# Altium schematic sheet pca10090_sheet3_nrf52840.SchDoc: nRF52840
size A3; Organization: Nordic Semiconductor; DocumentNumber: 3; SheetNumber: 3; SheetTotal: 8; CompanyName: Nordic Semiconductor; DocumentSize: A3
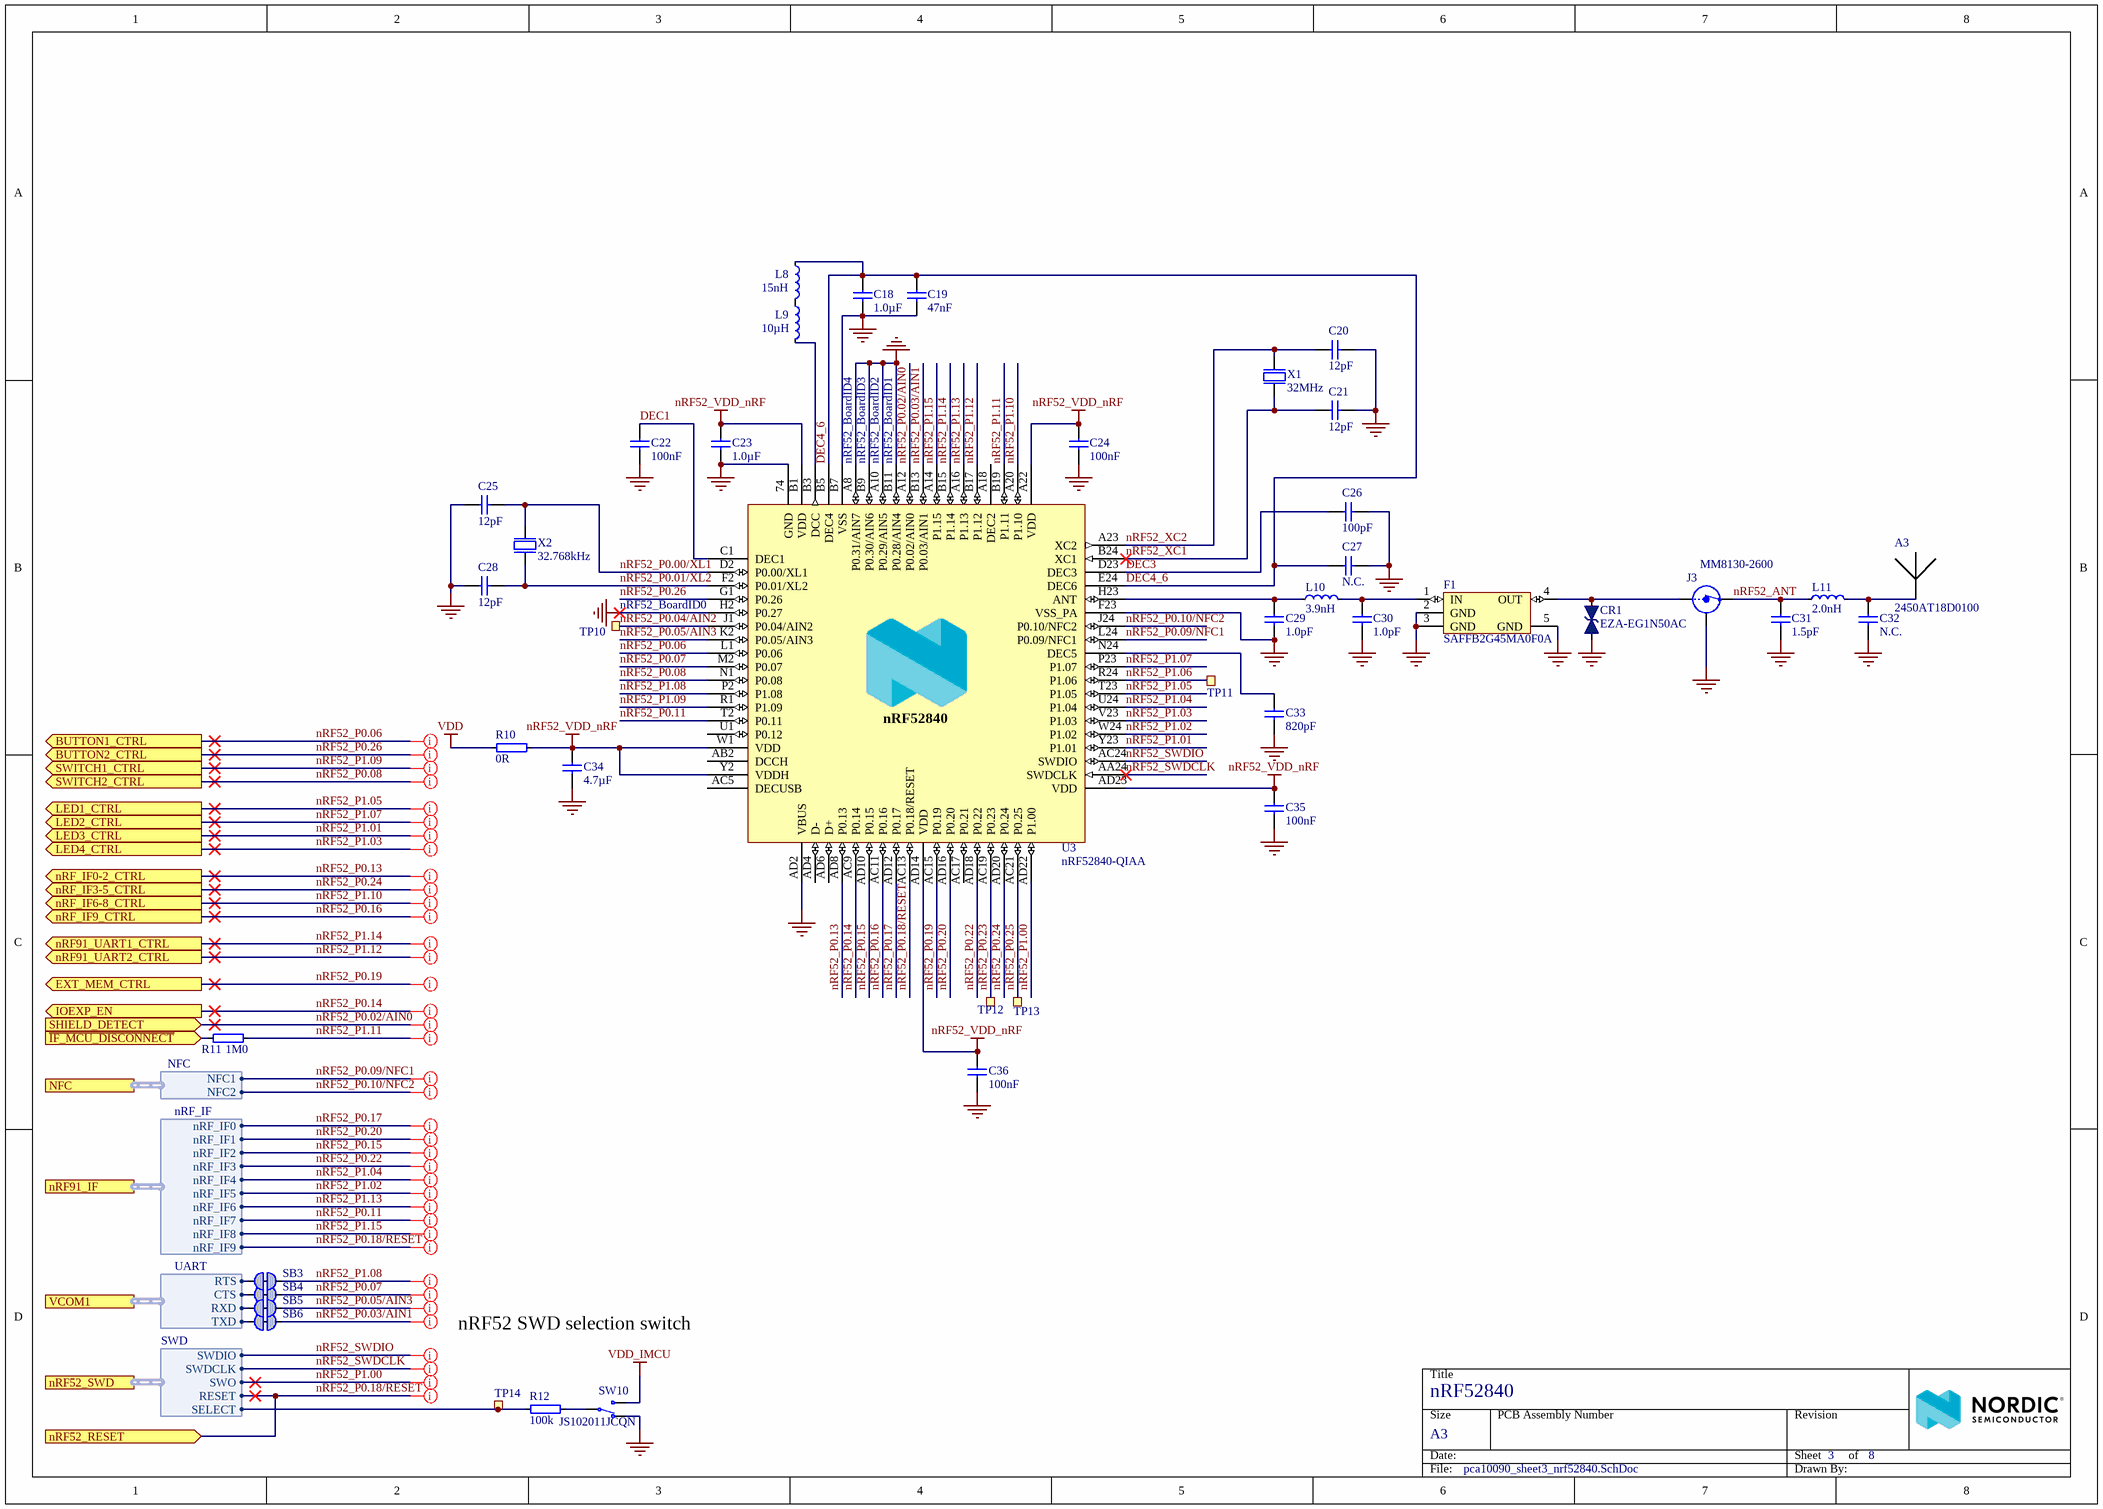
[diagram p0: pca10090_sheet3_nrf52840.SchDoc]

## Parts
A3  2450AT18D0100  [2450AT18D0100_STD-L]
C18  1.0µF  [CAPC1005X04L]
C19  47nF  [CAPC0603X03L_C]
C20  12pF  [CAPC0603X03L_C]
C21  12pF  [CAPC0603X03L_C]
C22  100nF  [CAPC0603X03L_C]
C23  1.0µF  [CAPC1005X04L]
C24  100nF  [CAPC0603X03L_C]
C25  12pF  [CAPC0603X03L_C]
C26  100pF  [CAPC0603X03L_C]
C27  N.C.  [CAPC0603X03L_C_NC]
C28  12pF  [CAPC0603X03L_C]
C29  1.0pF  [CAPC0603X03L_C]
C30  1.0pF  [CAPC0603X03L_C]
C31  1.5pF  [CAPC0603X03L_C]
C32  N.C.  [CAPC0603X03L_C_NC]
C33  820pF  [CAPC0603X03L_C]
C34  4.7µF  [CAPC1608X06L]
C35  100nF  [CAPC0603X03L_C]
C36  100nF  [CAPC0603X03L_C]
CR1  EZA-EG1N50AC  [RESC0603X03L_C]
F1  SAFFB2G45MA0F0A  [SAFFB2G45MA0F0A]
J3  MM8130-2600  [COAXIAL-SWF]
L8  15nH  [INDC1005X04L]
L9  10µH  [INDC1608X06L]
L10  3.9nH  [INDC0603X03L_C]
L11  2.0nH  [INDC0603X03L_C]
R10  0R  [RESC0603X03L_C]
R11  1M0  [RESC0603X03L_C]
R12  100k  [RESC0603X03L_C]
SB3  Solderbridge  [Solderbridge_Shorted]  (value not drawn)  (net tie, no BOM)
SB4  Solderbridge  [Solderbridge_Shorted]  (value not drawn)  (net tie, no BOM)
SB5  Solderbridge  [Solderbridge_Shorted]  (value not drawn)  (net tie, no BOM)
SB6  Solderbridge  [Solderbridge_Shorted]  (value not drawn)  (net tie, no BOM)
SW10  JS102011JCQN  [JS102011JCQN]
TP10  Ø1.5mm,SMD  [TP_SMD_D1.5mm]  (value not drawn)  (no BOM)
TP11  Ø1.5mm,SMD  [TP_SMD_D1.5mm]  (value not drawn)  (no BOM)
TP12  Ø1.5mm,SMD  [TP_SMD_D1.5mm]  (value not drawn)  (no BOM)
TP13  Ø1.5mm,SMD  [TP_SMD_D1.5mm]  (value not drawn)  (no BOM)
TP14  Ø1.5mm,SMD  [TP_SMD_D1.5mm]  (value not drawn)  (no BOM)
U3  nRF52840-QIAA  [AQFN50P700X700X85_HS-74N]
X1  32MHz  [BT-XTAL_2016]
X2  32.768kHz  [XTAL_3215]

## Ports
BUTTON1_CTRL (out), BUTTON2_CTRL (out), EXT_MEM_CTRL (out), IOEXP_EN (out), LED1_CTRL (out), LED2_CTRL (out), LED3_CTRL (out), LED4_CTRL (out), NFC (harness NFC), nRF52_RESET (in), nRF52_SWD (harness SWD), nRF91_IF (harness nRF_IF), nRF91_UART1_CTRL (out), nRF91_UART2_CTRL (out), nRF_IF0-2_CTRL (out), nRF_IF3-5_CTRL (out), nRF_IF6-8_CTRL (out), nRF_IF9_CTRL (out), SHIELD_DETECT (in), SWITCH1_CTRL (out), SWITCH2_CTRL (out), VCOM1 (harness UART), ~{IF_MCU_DISCONNECT} (in)

## Harnesses
UART: RTS, CTS, RXD, TXD
NFC: NFC1, NFC2
SWD: SWDIO, SWDCLK, SWO, RESET, SELECT
nRF_IF: nRF_IF0, nRF_IF1, nRF_IF2, nRF_IF3, nRF_IF4, nRF_IF5, nRF_IF6, nRF_IF7, nRF_IF8, nRF_IF9

## Nets
GND: A3.2(GND) C18.1 C19.1 C20.2 C21.2 C22.1 C23.1 C24.1 C25.1 C26.2 C27.1 C28.2 C29.1 C30.1 C31.2 C32.1 C33.1 C34.1 C35.1 C36.1 CR1.1 F1.2(GND) F1.3(GND) F1.5(GND) J3.2(Shield) SW10.1(N.C) U3.74(GND) U3.A8(P0.31/AIN7) U3.A10(P0.29/AIN5) U3.AD2(VBUS) U3.B7(VSS) U3.B9(P0.30/AIN6) U3.B11(P0.28/AIN4) U3.F23(VSS_PA) U3.H2(P0.27) X1.2(GND) X1.4(GND)
nRF52_VDD_nRF: C23.2 C24.2 C34.2 C35.2 C36.2 R10.2 U3.A22(VDD) U3.AD14(VDD) U3.AD23(VDD) U3.B1(VDD) U3.W1(VDD) U3.Y2(VDDH)
VDD: R10.1
VDD_IMCU: SW10.3(N.O)
DEC1: C22.2 U3.C1(DEC1)
DEC3: C26.1 U3.D23(DEC3)
DEC4_6: C18.2 C19.2 C27.2 L8.1 U3.B5(DEC4) U3.E24(DEC6)
~{IF_MCU_DISCONNECT}: R11.2 ; port ~{IF_MCU_DISCONNECT}
nRF52_ANT: C31.1 J3.3(OUT) L11.1
nRF52_P0.00/XL1: C25.2 U3.D2(P0.00/XL1) X2.1(inp)
nRF52_P0.01/XL2: C28.1 U3.F2(P0.01/XL2) X2.2(out)
nRF52_P0.02/AIN0: U3.A12(P0.02/AIN0) ; port SHIELD_DETECT
nRF52_P0.03/AIN1: SB6.1 U3.B13(P0.03/AIN1)
nRF52_P0.04/AIN2: TP10.1 U3.J1(P0.04/AIN2)
nRF52_P0.05/AIN3: SB5.1 U3.K2(P0.05/AIN3)
nRF52_P0.06: U3.L1(P0.06) ; port BUTTON1_CTRL
nRF52_P0.07: SB4.1 U3.M2(P0.07)
nRF52_P0.08: U3.N1(P0.08) ; port SWITCH2_CTRL
nRF52_P0.09/NFC1: U3.L24(P0.09/NFC1) ; port NFC.NFC1
nRF52_P0.10/NFC2: U3.J24(P0.10/NFC2) ; port NFC.NFC2
nRF52_P0.11: U3.T2(P0.11) ; port nRF91_IF.nRF_IF7
nRF52_P0.13: U3.AD8(P0.13) ; port nRF_IF0-2_CTRL
nRF52_P0.14: U3.AC9(P0.14) ; port IOEXP_EN
nRF52_P0.15: U3.AD10(P0.15) ; port nRF91_IF.nRF_IF2
nRF52_P0.16: U3.AC11(P0.16) ; port nRF_IF9_CTRL
nRF52_P0.17: U3.AD12(P0.17) ; port nRF91_IF.nRF_IF0
nRF52_P0.18/RESET: U3.AC13(P0.18/RESET) ; port nRF52_RESET, port nRF52_SWD.RESET, port nRF91_IF.nRF_IF9
nRF52_P0.19: U3.AC15(P0.19) ; port EXT_MEM_CTRL
nRF52_P0.20: U3.AD16(P0.20) ; port nRF91_IF.nRF_IF1
nRF52_P0.22: U3.AD18(P0.22) ; port nRF91_IF.nRF_IF3
nRF52_P0.23: TP12.1 U3.AC19(P0.23)
nRF52_P0.24: U3.AD20(P0.24) ; port nRF_IF3-5_CTRL
nRF52_P0.25: TP13.1 U3.AC21(P0.25)
nRF52_P0.26: U3.G1(P0.26) ; port BUTTON2_CTRL
nRF52_P1.00: U3.AD22(P1.00) ; port nRF52_SWD.SWO
nRF52_P1.01: U3.Y23(P1.01) ; port LED3_CTRL
nRF52_P1.02: U3.W24(P1.02) ; port nRF91_IF.nRF_IF5
nRF52_P1.03: U3.V23(P1.03) ; port LED4_CTRL
nRF52_P1.04: U3.U24(P1.04) ; port nRF91_IF.nRF_IF4
nRF52_P1.05: U3.T23(P1.05) ; port LED1_CTRL
nRF52_P1.06: TP11.1 U3.R24(P1.06)
nRF52_P1.07: U3.P23(P1.07) ; port LED2_CTRL
nRF52_P1.08: SB3.1 U3.P2(P1.08)
nRF52_P1.09: U3.R1(P1.09) ; port SWITCH1_CTRL
nRF52_P1.10: U3.A20(P1.10) ; port nRF_IF6-8_CTRL
nRF52_P1.11: R11.1 U3.B19(P1.11)
nRF52_P1.12: U3.B17(P1.12) ; port nRF91_UART2_CTRL
nRF52_P1.13: U3.A16(P1.13) ; port nRF91_IF.nRF_IF6
nRF52_P1.14: U3.B15(P1.14) ; port nRF91_UART1_CTRL
nRF52_P1.15: U3.A14(P1.15) ; port nRF91_IF.nRF_IF8
nRF52_SWDCLK: U3.AA24(SWDCLK) ; port nRF52_SWD.SWDCLK
nRF52_SWDIO: U3.AC24(SWDIO) ; port nRF52_SWD.SWDIO
nRF52_XC1: C21.1 U3.B24(XC1) X1.1(inp)
nRF52_XC2: C20.1 U3.A23(XC2) X1.3(out)
NetA3_1: A3.1 C32.2 L11.2
NetC29_2: C29.2 L10.1 U3.H23(ANT)
NetC30_2: C30.2 F1.1(IN) L10.2
NetC33_2: C33.2 U3.N24(DEC5)
NetCR1_2: CR1.2 F1.4(OUT) J3.1(IN)
NetL8_2: L8.2 L9.1
NetL9_2: L9.2 U3.B3(DCC)
NetR12_1: R12.1 SW10.2(COM)
NetR12_2: R12.2 TP14.1 ; port nRF52_SWD.SELECT
NetSB3_2: SB3.2 ; port VCOM1.RTS
NetSB4_2: SB4.2 ; port VCOM1.CTS
NetSB5_2: SB5.2 ; port VCOM1.RXD
NetSB6_2: SB6.2 ; port VCOM1.TXD

Not connected (* = marked no-connect by the designer): U3 A18(DEC2) AB2(DCCH) AC5(DECUSB) AC17(P0.21) AD4(D-) AD6(D+) U1(P0.12)

## Layout directives
net class GPIO: nRF52_P0.02/AIN0, nRF52_P0.03/AIN1, nRF52_P0.05/AIN3, nRF52_P0.06, nRF52_P0.07, nRF52_P0.08, nRF52_P0.09/NFC1, nRF52_P0.10/NFC2, nRF52_P0.11, nRF52_P0.13, nRF52_P0.14, nRF52_P0.15, nRF52_P0.16, nRF52_P0.17, nRF52_P0.18/RESET, nRF52_P0.19, nRF52_P0.20, nRF52_P0.22, nRF52_P0.24, nRF52_P0.26, nRF52_P1.01, nRF52_P1.02, nRF52_P1.03, nRF52_P1.04, nRF52_P1.05, nRF52_P1.07, nRF52_P1.08, nRF52_P1.09, nRF52_P1.10, nRF52_P1.11, nRF52_P1.12, nRF52_P1.13, nRF52_P1.14, nRF52_P1.15
net class SWD: nRF52_P0.18/RESET, nRF52_P1.00, nRF52_SWDCLK, nRF52_SWDIO

## Notes on the sheet
- nRF52_BoardID4
- (near U3) nRF52_BoardID3
- (near U3) nRF52_BoardID2
- (near U3) nRF52_BoardID1
- (near TP10) nRF52_BoardID0
- nRF52 SWD selection switch
- Title
- Size
- Date:
- A3
- PCB Assembly Number
- Sheet         of
- Revision
- File:
- Drawn By:
- (in symbol nRF52840-QIAAF0) nRF52840

## Library data of the parts
A3 = Johanson 2450AT18D0100_STD-L: 2.45 GHz chip antenna; Manufacturer: Johanson Technology; Part number IPS: 00000001415; Note: N.A.; Artikkelnr Noca: 53059035; Pad Count: 4; Part Number: Johanson 2450AT18D0100_STD-L; Manufacturer Part Number: 2450AT18D0100; ComponentLink1URL: N.A.; ComponentLink1Description: Datasheet; ComponentLink2URL: N.A.; ComponentLink2Description: Supplier link; HelpURL: http://www.johansontechnology.com/datasheets/antennas/2450AT18D0100.pdf; Footprint Doc: 2450AT18D0100; LatestRevisionDate: 2016-06-02; Published: 2016-01-12; Value: 2450AT18D0100; Supplier 1: Digi-Key; Supplier Part Number 1: 2450AT18D0100E; Supplier 2: Mouser; Supplier Part Number 2: 609-2450AT18D0100E; PartId: 100700004; Component Class: Antennas; Author: rsk; Part number Norautron: N.A.
C18 C23 = C0402-1µ0-6.3V-X5R: Capacitor, X5R, ±5%, 6.3V; Manufacturer: N.A.; Part number IPS: 00000007786, 00000003457; Artikkelnr Noca: 20039235; Pad Count: 2; Part Number: C0402-1µ0-6.3V-X5R; Manufacturer Part Number: N.A.; ComponentLink1URL: N.A.; ComponentLink1Description: Datasheet; ComponentLink2URL: N.A.; ComponentLink2Description: Supplier link; HelpURL: N.A.; Footprint Doc: 0402; LatestRevisionDate: 2021-07-22; Published: 2009-05-08; Value: 1.0µF; Note: 6.3V; Supplier 1: Digi-Key; Supplier Part Number 1: 1276-1444-1-ND; Supplier 2: N.A.; Supplier Part Number 2: N.A.; PartId: 100200190; Component Class: Capacitors; Author: rsk; Part number Norautron: N.A.
C19 = C0201-47n: Capacitor, X5R, ±10%; Manufacturer: N.A.; Part number IPS: 00000001250; Note: 10V; Pad Count: 2; Part Number: C0201-47n; Manufacturer Part Number: N.A.; ComponentLink1URL: N.A.; ComponentLink1Description: Datasheet; ComponentLink2URL: N.A.; ComponentLink2Description: Supplier link; HelpURL: N.A.; Footprint Doc: 0201; LatestRevisionDate: 2017-11-09; Published: 2014-11-13; Value: 47nF; Artikkelnr Noca: N.A.; Supplier 1: N.A.; Supplier Part Number 1: N.A.; Supplier 2: N.A.; Supplier Part Number 2: N.A.; PartId: 100200074; Component Class: Capacitors; Author: rsk; Part number Norautron: N.A.
C20 C21 C25 C28 = C0201-12p: Capacitor, NP0, ±2%; Manufacturer: N.A.; Part number IPS: 00000007848; Note: 25V; Pad Count: 2; Part Number: C0201-12p; Manufacturer Part Number: N.A.; ComponentLink1URL: N.A.; ComponentLink1Description: Datasheet; ComponentLink2URL: N.A.; ComponentLink2Description: Supplier link; HelpURL: N.A.; Footprint Doc: 0201; LatestRevisionDate: 2017-11-09; Published: 2014-11-13; Value: 12pF; Artikkelnr Noca: N.A.; Supplier 1: N.A.; Supplier Part Number 1: N.A.; Supplier 2: N.A.; Supplier Part Number 2: N.A.; PartId: 100200033; Component Class: Capacitors; Author: rsk; Part number Norautron: N.A.
C22 C24 C35 C36 = C0201-100n: Capacitor, X5R, ±10%; Manufacturer: N.A.; Part number IPS: 00000001248, 00000002505; Note: 16V; Pad Count: 2; Part Number: C0201-100n; Manufacturer Part Number: N.A.; ComponentLink1URL: N.A.; ComponentLink1Description: Datasheet; ComponentLink2URL: N.A.; ComponentLink2Description: Supplier link; HelpURL: N.A.; Footprint Doc: 0201; LatestRevisionDate: 2017-11-09; Published: 2014-11-13; Value: 100nF; Artikkelnr Noca: N.A.; Supplier 1: N.A.; Supplier Part Number 1: N.A.; Supplier 2: N.A.; Supplier Part Number 2: N.A.; PartId: 100200078; Component Class: Capacitors; Author: rsk; Part number Norautron: N.A.
C26 = C0201-100p: Capacitor, NP0, ±2%, 25V; Manufacturer: Murata; Manufacturer Part Number: GRM0335C1E101GA01; Part number IPS: 00000007853; Artikkelnr Noca: N.A.; Pad Count: 2; Part Number: C0201-100p; ComponentLink1URL: N.A.; ComponentLink1Description: Datasheet; ComponentLink2URL: N.A.; ComponentLink2Description: Supplier link; HelpURL: N.A.; Footprint Doc: 0201; LatestRevisionDate: 2019-04-16; Published: 2019-04-16; Value: 100pF; Note: 25V; Supplier 1: N.A.; Supplier Part Number 1: N.A.; Supplier 2: N.A.; Supplier Part Number 2: N.A.; PartId: 100200044; Component Class: Capacitors; Author: rsk; Part number Norautron: N.A.
C27 C32 = C0201-N.C.: Not mounted; Manufacturer: N.A.; Note: Chip Cap; Assembly: Not mounted; Pad Count: 2; Part Number: C0201-N.C.; Manufacturer Part Number: N.A.; ComponentLink1URL: N.A.; ComponentLink1Description: Datasheet; ComponentLink2URL: N.A.; ComponentLink2Description: Supplier link; HelpURL: N.A.; Footprint Doc: 0201; LatestRevisionDate: 2014-11-13; Published: 2014-11-13; Value: N.C.; Artikkelnr Noca: N.A.; Part number IPS: N.A.; Supplier 1: N.A.; Supplier Part Number 1: N.A.; Supplier 2: N.A.; Supplier Part Number 2: N.A.; PartId: 100200001; Component Class: Capacitors; Author: rsk; Part number Norautron: N.A.
C29 C30 = C0201-1.0p: Capacitor, NP0, ±0.05pF, 50V; Manufacturer: N.A.; Part number IPS: 00000001247; Pad Count: 2; Part Number: C0201-1.0p; Manufacturer Part Number: N.A.; ComponentLink1URL: N.A.; ComponentLink1Description: Datasheet; ComponentLink2URL: N.A.; ComponentLink2Description: Supplier link; HelpURL: N.A.; Footprint Doc: 0201; LatestRevisionDate: 2018-10-22; Published: 2014-11-13; Value: 1.0pF; Note: 50V; Artikkelnr Noca: N.A.; Supplier 1: N.A.; Supplier Part Number 1: N.A.; Supplier 2: N.A.; Supplier Part Number 2: N.A.; PartId: 100200014; Component Class: Capacitors; Author: rsk; Part number Norautron: N.A.
C31 = C0201-1.5p: Capacitor, NP0, ±0.1pF; Manufacturer: N.A.; Part number IPS: 00000007107; Note: 50V; Pad Count: 2; Part Number: C0201-1.5p; Manufacturer Part Number: N.A.; ComponentLink1URL: N.A.; ComponentLink1Description: Datasheet; ComponentLink2URL: N.A.; ComponentLink2Description: Supplier link; HelpURL: N.A.; Footprint Doc: 0201; LatestRevisionDate: 2017-11-09; Published: 2014-11-13; Value: 1.5pF; Supplier 1: N.A.; Supplier Part Number 1: N.A.; Supplier 2: N.A.; Supplier Part Number 2: N.A.; Artikkelnr Noca: N.A.; PartId: 100200017; Component Class: Capacitors; Author: rsk; Part number Norautron: N.A.
C33 = C0201-820p: Capacitor, X7R, ±10%; Manufacturer: N.A.; Part number IPS: 00000001249; Note: 25V; Pad Count: 2; Part Number: C0201-820p; Manufacturer Part Number: N.A.; ComponentLink1URL: N.A.; ComponentLink1Description: Datasheet; ComponentLink2URL: N.A.; ComponentLink2Description: Supplier link; HelpURL: N.A.; Footprint Doc: 0201; LatestRevisionDate: 2017-11-09; Published: 2014-11-13; Value: 820pF; Artikkelnr Noca: N.A.; Supplier 1: N.A.; Supplier Part Number 1: N.A.; Supplier 2: N.A.; Supplier Part Number 2: N.A.; PartId: 100200055; Component Class: Capacitors; Author: rsk; Part number Norautron: N.A.
C34 = C0603-4µ7: Capacitor, X5R, ±10%; Manufacturer: N.A.; Part number IPS: 00000007783; Note: 6.3V; Artikkelnr Noca: 20069060; Pad Count: 2; Part Number: C0603-4µ7; Manufacturer Part Number: N.A.; ComponentLink1URL: N.A.; ComponentLink1Description: Datasheet; ComponentLink2URL: N.A.; ComponentLink2Description: Supplier link; HelpURL: N.A.; Footprint Doc: 0603; LatestRevisionDate: 2009-11-23; Published: 2009-05-08; Value: 4.7µF; Supplier 1: N.A.; Supplier Part Number 1: N.A.; Supplier 2: N.A.; Supplier Part Number 2: N.A.; PartId: 100200274; Component Class: Capacitors; Author: rsk; Part number Norautron: N.A.
CR1 = EZA-EG1N50AC: ESD Suppressor, 30V, 0.04pF; Manufacturer: Panasonic; Part number IPS: 00000004437; Note: N.A.; Pad Count: 2; Part Number: EZA-EG1N50AC; Manufacturer Part Number: EZA-EG1N50AC; ComponentLink1URL: https://industrial.panasonic.com/cdbs/www-data/pdf/AWD0000/AWD0000C13.pdf; ComponentLink1Description: Datasheet; ComponentLink2URL: N.A.; ComponentLink2Description: Supplier link; HelpURL: N.A.; Footprint Doc: 0201; LatestRevisionDate: 2020-04-28; Published: 2020-02-06; Value: EZA-EG1N50AC; Artikkelnr Noca: N.A.; Supplier 1: Digi-Key; Supplier Part Number 1: P122037CT-ND; Supplier 2: N.A.; Supplier Part Number 2: N.A.; PartId: 101300173; Component Class: Semiconductors; Author: rsk; Part number Norautron: N.A.
F1 = SAFFB2G45MA0F0A: 2.4 GHz BPF; Manufacturer: Murata; Part number IPS: 00000001784, 80000001660; Artikkelnr Noca: N.A.; Pad Count: 5; Part Number: SAFFB2G45MA0F0A; Manufacturer Part Number: SAFFB2G45MA0F0A; ComponentLink1URL: N.A.; ComponentLink1Description: Datasheet; ComponentLink2URL: N.A.; ComponentLink2Description: Supplier link; HelpURL: N.A.; Footprint Doc: 1109; LatestRevisionDate: 2018-05-15; Published: 2018-05-15; Value: SAFFB2G45MA0F0A; Supplier 1: N.A.; Supplier Part Number 1: N.A.; Supplier 2: N.A.; Supplier Part Number 2: N.A.; PartId: 100800023; Component Class: Filters; Note: N.A.; Author: rsk; Part number Norautron: N.A.
J3 = MM8130-2600: Coaxial Connector with Switch; Manufacturer: Murata; Part number IPS: 00000009955; Note: N.A.; Artikkelnr Noca: 55029011; Pad Count: 3; Part Number: MM8130-2600; Manufacturer Part Number: MM8130-2600; LatestRevisionDate: 2014-04-24; Published: 2014-04-24; Value: MM8130-2600; Footprint Doc: COAXIAL-SWF; ComponentLink1URL: N.A.; ComponentLink1Description: Datasheet; ComponentLink2URL: N.A.; ComponentLink2Description: Supplier link; HelpURL: http://www.murata.com/products/catalog/pdf/o33e.pdf; Supplier 1: Digi-Key; Supplier Part Number 1: 490-4981-1-ND; Supplier 2: Mouser; Supplier Part Number 2: 81-MM8130-2600RA2; PartId: 100500400; Component Class: Connectors; Author: rsk; Part number Norautron: N.A.
L8 = L0402-15n: Inductor, 320mA, ±5%; Manufacturer: Taiyo Yuden; Manufacturer Part Number: HK100515NJ-T; Part number IPS: 00000001262; Part number Norautron: N.A.; Note: High frequency chip inductor ±10%; Artikkelnr Noca: 33029323; Pad Count: 2; Part Number: L0402-15n; LatestRevisionDate: 2012-09-19; Published: 2010-07-12; Value: 15nH; Footprint Doc: 0402; ComponentLink1Description: Datasheet; ComponentLink2Description: Supplier link; ComponentLink1URL: N.A.; ComponentLink2URL: N.A.; HelpURL: http://www.yuden.co.jp/productdata/catalog/en/mlci04_e.pdf; Supplier 1: Digi-Key; Supplier Part Number 1: 587-1521-1-ND; Supplier 2: Farnell; Supplier Part Number 2: 658-1328; PartId: 100300056; Component Class: Inductors; Author: rsk
L9 = L0603-10µ: Inductor, 80mA, ±10%; Manufacturer: Taiyo Yuden; Manufacturer Part Number: LBMF1608T100K; Part number IPS: 00000007794; Part number Norautron: N.A.; Note: LBMF1608T100K 10µH 80mA 0603; Artikkelnr Noca: 33029314; Pad Count: 2; Part Number: L0603-10µ; LatestRevisionDate: 2012-09-19; Published: 2010-02-24; Value: 10µH; Footprint Doc: 0603; ComponentLink1Description: Datasheet; ComponentLink2Description: Supplier link; ComponentLink1URL: N.A.; ComponentLink2URL: N.A.; HelpURL: http://www.yuden.co.jp/ut/product/pdf/elb2_e.pdf; Supplier 1: Digi-Key; Supplier Part Number 1: 587-1714-1-ND; Supplier 2: Farnell; Supplier Part Number 2: 178-6105; PartId: 100300078; Component Class: Inductors; Author: rsk
L10 = L0201-3n9: Inductor, 400mA, ±0.1nH; Manufacturer: Murata; Manufacturer Part Number: LQP03TN3N9B02D; Part number IPS: 00000001253; Note: N.A.; Pad Count: 2; Part Number: L0201-3n9; ComponentLink1URL: N.A.; ComponentLink1Description: Datasheet; ComponentLink2Description: Supplier link; HelpURL: N.A.; Footprint Doc: 0201; LatestRevisionDate: 2017-11-09; Published: 2013-04-10; Value: 3.9nH; Artikkelnr Noca: N.A.; ComponentLink2URL: N.A.; Supplier 1: N.A.; Supplier Part Number 1: N.A.; Supplier 2: N.A.; Supplier Part Number 2: N.A.; PartId: 100300022; Component Class: Inductors; Author: rsk; Part number Norautron: N.A.
L11 = L0201-2n0: Chip Inductor; Manufacturer: Murata; Manufacturer Part Number: LQP03TN2N0B02D; Part number IPS: 00000001670; Note: High frequency chip inductor ±5%; Artikkelnr Noca: N.A.; Pad Count: 2; Part Number: L0201-2n0; ComponentLink1URL: N.A.; ComponentLink1Description: Datasheet; ComponentLink2URL: N.A.; ComponentLink2Description: Supplier link; HelpURL: http://www.murata.com/~/media/webrenewal/support/library/catalog/products/inductor/chip/o05e.ashx; Footprint Doc: 0201; LatestRevisionDate: 2016-04-19; Published: 2016-04-19; Value: 2.0nH; Supplier 1: Digi-Key; Supplier Part Number 1: 490-12983-1-ND; Supplier 2: N.A.; Supplier Part Number 2: N.A.; PartId: 100300016; Component Class: Inductors; Author: rsk; Part number Norautron: N.A.
R10 = R0201-0R: Resistor, ±5%, 0.05W; Manufacturer: N.A.; Part number IPS: 00000003245; Note: Chip Res 5%; Pad Count: 2; Part Number: R0201-0R; Manufacturer Part Number: N.A.; ComponentLink1URL: N.A.; ComponentLink1Description: Datasheet; ComponentLink2URL: N.A.; ComponentLink2Description: Supplier link; HelpURL: N.A.; Footprint Doc: 0201; LatestRevisionDate: 2017-11-09; Published: 2014-11-13; Value: 0R; Artikkelnr Noca: N.A.; Supplier 1: N.A.; Supplier Part Number 1: N.A.; Supplier 2: N.A.; Supplier Part Number 2: N.A.; PartId: 100100001; Component Class: Resistors; Author: rsk; Part number Norautron: N.A.
R11 = R0201-1M0: Resistor, ±1%, 0.05W; Manufacturer: N.A.; Part number IPS: 00000001418; Note: Chip Res 1%; Pad Count: 2; Part Number: R0201-1M0; Manufacturer Part Number: N.A.; ComponentLink1URL: N.A.; ComponentLink1Description: Datasheet; ComponentLink2URL: N.A.; ComponentLink2Description: Supplier link; HelpURL: N.A.; Footprint Doc: 0201; LatestRevisionDate: 2014-11-13; Published: 2014-11-13; Value: 1M0; Artikkelnr Noca: N.A.; Supplier 1: N.A.; Supplier Part Number 1: N.A.; Supplier 2: N.A.; Supplier Part Number 2: N.A.; PartId: 100100093; Component Class: Resistors; Author: rsk; Part number Norautron: N.A.
R12 = R0201-100k: Resistor, ±1%, 0.05W; Manufacturer: N.A.; Part number IPS: 00000001419; Note: Chip Res 1%; Pad Count: 2; Part Number: R0201-100k; Manufacturer Part Number: N.A.; ComponentLink1URL: N.A.; ComponentLink1Description: Datasheet; ComponentLink2URL: N.A.; ComponentLink2Description: Supplier link; HelpURL: N.A.; Footprint Doc: 0201; LatestRevisionDate: 2014-11-13; Published: 2014-11-13; Value: 100k; Supplier 1: N.A.; Supplier Part Number 1: N.A.; Supplier 2: N.A.; Supplier Part Number 2: N.A.; Artikkelnr Noca: N.A.; PartId: 100100080; Component Class: Resistors; Author: rsk; Part number Norautron: N.A.
SB3-SB6 = Solderbridge Shorted: Shorted Solderbridge; Manufacturer: N.A.; Pad Count: 2; Part Number: Solderbridge Shorted; Manufacturer Part Number: N.A.; Footprint Doc: Solderbridge_Shorted; LatestRevisionDate: 2012-08-07; Published: 2012-08-07; Value: Solderbridge; Note: N.A.; Artikkelnr Noca: N.A.; Part number IPS: N.A.; ComponentLink1URL: N.A.; ComponentLink1Description: Datasheet; ComponentLink2URL: N.A.; ComponentLink2Description: Supplier link; HelpURL: N.A.; Supplier 1: N.A.; Supplier Part Number 1: N.A.; Supplier 2: N.A.; Supplier Part Number 2: N.A.; PartId: 100500459; Component Class: Connectors; Author: rsk; Part number Norautron: N.A.
SW10 = JS102011JCQN: Sub-Miniature Slide Switch, SPDT, 300mA, 6V, Vertical, SMD; Manufacturer: C&K; Part number IPS: 00000009980; Note: N.A.; Pad Count: 3; Part Number: JS102011JCQN; Manufacturer Part Number: JS102011JCQN; LatestRevisionDate: 2020-10-23; Published: 2017-02-15; Value: JS102011JCQN; Artikkelnr Noca: N.A.; ComponentLink1URL: https://www.ckswitches.com/media/1422/js.pdf; ComponentLink1Description: Datasheet; ComponentLink2URL: https://www.digikey.com/en/products/detail/c-k/JS102011JCQN/6137628; ComponentLink2Description: Supplier link; HelpURL: https://www.ckswitches.com/products/switches/product-details/Slide/JS/JS102011JCQN/; Footprint Doc: JS102011JCQN; Supplier 1: Digi-Key; Supplier Part Number 1: CKN10721CT-ND; Supplier 2: Mouser; Supplier Part Number 2: 611-JS102011JCQN; PartId: 101500055; Component Class: Switches; Author: rsk; Part number Norautron: N.A.
TP10-TP14 = TP_SMD_Ø1.5MM: 1.5mm circular SMD testpad; Manufacturer: Nordic Semiconductor; Manufacturer Part Number: N.A.; Pad Count: 1; Part Number: TP_SMD_Ø1.5MM; ComponentLink1URL: N.A.; ComponentLink1Description: Datasheet; ComponentLink2URL: N.A.; ComponentLink2Description: Supplier link; HelpURL: N.A.; Footprint Doc: TP_SMD_Ø1.5mm; LatestRevisionDate: 2021-03-05; Published: 2016-06-02; Value: Ø1.5mm,SMD; Note: N.A.; Artikkelnr Noca: N.A.; Part number IPS: N.A.; Supplier 1: N.A.; Supplier Part Number 1: N.A.; Supplier 2: N.A.; Supplier Part Number 2: N.A.; PartId: 100500477; Component Class: Connectors; Author: rsk; Part number Norautron: N.A.
U3 = nRF52840-QIAAF0: Multi-protocol Bluetooth Low Energy, IEEE 802.15.4, ANT and 2.4GHz proprietary system-on-chip; Manufacturer: Nordic Semiconductor; Part number IPS: 80000002377; Note: N.A.; Pad Count: 73; Part Number: nRF52840-QIAAF0; Manufacturer Part Number: nRF52840-QIAAF0; LatestRevisionDate: 2021-03-24; Published: 2021-03-24; Value: nRF52840-QIAA; Artikkelnr Noca: N.A.; Footprint Doc: AQFN-73; ComponentLink1URL: N.A.; ComponentLink1Description: Datasheet; ComponentLink2URL: N.A.; ComponentLink2Description: Supplier link; HelpURL: N.A.; Supplier 1: Nordic Semiconductor; Supplier Part Number 1: nRF52840-QIAAF0; Supplier 2: N.A.; Supplier Part Number 2: N.A.; PartId: 102000222; Component Class: nRF_Devices; Author: hany; Part number Norautron: N.A.
X1 = XTAL_SMD2016_32MHz_8pF_Golledge: XTAL SMD 2016, 32MHz, Cl=8pF, Tol: ±10ppm, Stab: ±15ppm; Manufacturer Part Number: MP06003; Part number IPS: 00000001431; Part number Norautron: N.A.; Note: XTAL SMD 32.000MHz; Artikkelnr Noca: 22010050; Pad Count: 4; Part Number: XTAL_SMD2016_32MHz_8pF_Golledge; LatestRevisionDate: 2016-11-02; Published: 2016-11-02; Value: 32MHz; Footprint Doc: XTAL_2016; Manufacturer: Golledge; ComponentLink1URL: N.A.; ComponentLink1Description: Datasheet; ComponentLink2URL: N.A.; ComponentLink2Description: Supplier link; HelpURL: \\hizz\pro\app9717\Datasheet\crystals\Golledge\mp06003.pdf; Supplier 1: Link Nordic; Supplier Part Number 1: N.A.; Supplier 2: N.A.; Supplier Part Number 2: N.A.; PartId: 101600041; Component Class: Oscillators; Author: rsk
X2 = XTAL_SMD3215_32.768kHz_9pF_NDK: XTAL SMD 3215, 32.768kHz, 9pF, ±20ppm; Manufacturer: NDK; Manufacturer Part Number: NX3215SA-32.768K-STD-MUA-9; Part number IPS: 00000005419; Part number Norautron: N.A.; Note: XTAL SMD 32.768kHz; Artikkelnr Noca: 22010049; Pad Count: 2; Part Number: XTAL_SMD3215_32.768kHz_9pF_NDK; LatestRevisionDate: 2017-10-23; Published: 2017-10-23; Value: 32.768kHz; Footprint Doc: XTAL_3215; ComponentLink1URL: N.A.; ComponentLink1Description: Datasheet; ComponentLink2URL: N.A.; ComponentLink2Description: Supplier link; HelpURL: N.A.; Supplier 1: N.A.; Supplier Part Number 1: N.A.; Supplier 2: N.A.; Supplier Part Number 2: N.A.; PartId: 101600019; Component Class: Oscillators; Author: rsk